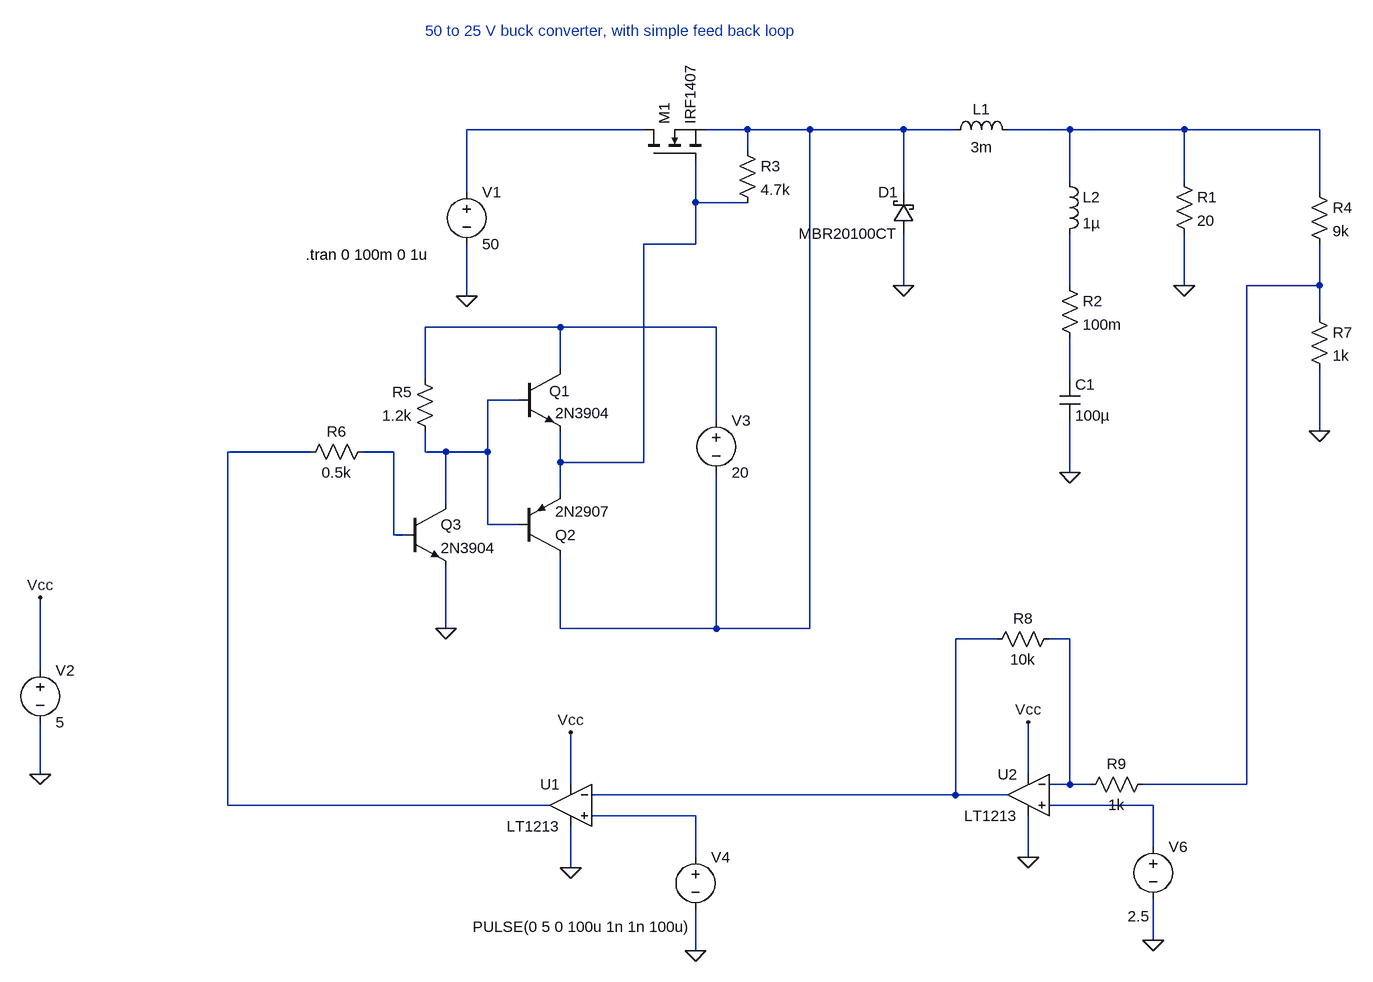
[diagram p0: schematic buck_converter.asc]
buck_converter.asc, the LTspice schematic file:
Version 4
SHEET 1 1340 1476
WIRE -208 32 -480 32
WIRE -48 32 -112 32
WIRE 48 32 -48 32
WIRE 192 32 48 32
WIRE 272 32 192 32
WIRE 448 32 352 32
WIRE 624 32 448 32
WIRE 832 32 624 32
WIRE -48 64 -48 32
WIRE 448 112 448 32
WIRE 624 112 624 32
WIRE -480 128 -480 32
WIRE 192 128 192 32
WIRE 832 128 832 32
WIRE -128 144 -128 80
WIRE -48 144 -128 144
WIRE -128 208 -128 144
WIRE -128 208 -208 208
WIRE 192 272 192 192
WIRE 448 272 448 192
WIRE 624 272 624 192
WIRE 832 272 832 208
WIRE 832 272 720 272
WIRE -480 288 -480 208
WIRE 832 320 832 272
WIRE -336 336 -544 336
WIRE -96 336 -336 336
WIRE -336 400 -336 336
WIRE -544 416 -544 336
WIRE 448 416 448 352
WIRE -400 448 -448 448
WIRE -96 480 -96 336
WIRE 832 496 832 400
WIRE -720 528 -848 528
WIRE -592 528 -640 528
WIRE -544 528 -544 496
WIRE -512 528 -544 528
WIRE -448 528 -448 448
WIRE -448 528 -512 528
WIRE -336 544 -336 496
WIRE -208 544 -208 208
WIRE -208 544 -336 544
WIRE 448 560 448 480
WIRE -336 592 -336 544
WIRE -512 608 -512 528
WIRE -448 640 -448 528
WIRE -400 640 -448 640
WIRE -592 656 -592 528
WIRE -576 656 -592 656
WIRE -512 800 -512 704
WIRE -336 800 -336 688
WIRE -96 800 -96 560
WIRE -96 800 -336 800
WIRE 48 800 48 32
WIRE 48 800 -96 800
WIRE 336 816 272 816
WIRE 448 816 416 816
WIRE -1136 864 -1136 752
WIRE -1136 1024 -1136 944
WIRE 384 1024 384 944
WIRE -320 1040 -320 960
WIRE 448 1040 448 816
WIRE 448 1040 416 1040
WIRE 480 1040 448 1040
WIRE 720 1040 720 272
WIRE 720 1040 560 1040
WIRE 272 1056 272 816
WIRE 272 1056 -288 1056
WIRE 352 1056 272 1056
WIRE -848 1072 -848 528
WIRE -352 1072 -848 1072
WIRE 576 1072 416 1072
WIRE -128 1088 -288 1088
WIRE 576 1136 576 1072
WIRE -128 1152 -128 1088
WIRE 384 1152 384 1088
WIRE -320 1168 -320 1104
WIRE 576 1280 576 1216
WIRE -128 1296 -128 1232
FLAG 192 272 0
FLAG -480 288 0
FLAG 448 560 0
FLAG 624 272 0
FLAG -512 800 0
FLAG -1136 1024 0
FLAG -1136 752 Vcc
FLAG -320 960 Vcc
FLAG -320 1168 0
FLAG -128 1296 0
FLAG 384 944 Vcc
FLAG 384 1152 0
FLAG 576 1280 0
FLAG 832 496 0
SYMBOL voltage -480 112 R0
WINDOW 123 0 0 Left 0
WINDOW 39 0 0 Left 0
SYMATTR InstName V1
SYMATTR Value 50
SYMBOL nmos -208 80 R270
SYMATTR InstName M1
SYMATTR Value IRF1407
SYMBOL ind 256 48 R270
WINDOW 0 32 56 VTop 2
WINDOW 3 5 56 VBottom 2
SYMATTR InstName L1
SYMATTR Value 3m
SYMBOL schottky 208 192 R180
WINDOW 0 24 64 Left 2
WINDOW 3 24 0 Left 2
SYMATTR InstName D1
SYMATTR Value MBR20100CT
SYMATTR Description Diode
SYMATTR Type diode
SYMBOL cap 432 416 R0
SYMATTR InstName C1
SYMATTR Value 100µ
SYMBOL res 608 96 R0
SYMATTR InstName R1
SYMATTR Value 20
SYMBOL res 432 256 R0
SYMATTR InstName R2
SYMATTR Value 100m
SYMBOL ind 432 96 R0
SYMATTR InstName L2
SYMATTR Value 1µ
SYMBOL res -64 48 R0
SYMATTR InstName R3
SYMATTR Value 4.7k
SYMBOL npn -400 400 R0
WINDOW 0 47 34 Left 2
SYMATTR InstName Q1
SYMATTR Value 2N3904
SYMBOL res -528 512 R180
WINDOW 0 36 76 Left 2
WINDOW 3 36 40 Left 2
SYMATTR InstName R5
SYMATTR Value 1.2k
SYMBOL pnp -400 688 M180
SYMATTR InstName Q2
SYMATTR Value 2N2907
SYMBOL res -624 512 R90
WINDOW 0 0 56 VBottom 2
WINDOW 3 32 56 VTop 2
SYMATTR InstName R6
SYMATTR Value 0.5k
SYMBOL npn -576 608 R0
SYMATTR InstName Q3
SYMATTR Value 2N3904
SYMBOL voltage -96 464 R0
WINDOW 123 0 0 Left 0
WINDOW 39 0 0 Left 0
SYMATTR InstName V3
SYMATTR Value 20
SYMBOL OpAmps\\LT1213 -320 1008 M0
SYMATTR InstName U1
SYMBOL voltage -1136 848 R0
WINDOW 123 0 0 Left 0
WINDOW 39 0 0 Left 0
SYMATTR InstName V2
SYMATTR Value 5
SYMBOL voltage -128 1136 R0
WINDOW 123 0 0 Left 0
WINDOW 39 0 0 Left 0
WINDOW 3 -5 123 Right 2
SYMATTR InstName V4
SYMATTR Value PULSE(0 5 0 100u 1n 1n 100u)
SYMBOL OpAmps\\LT1213 384 992 M0
SYMATTR InstName U2
SYMBOL voltage 576 1120 R0
WINDOW 123 0 0 Left 0
WINDOW 39 0 0 Left 0
WINDOW 3 -5 123 Right 2
SYMATTR InstName V6
SYMATTR Value 2.5
SYMBOL res 816 112 R0
SYMATTR InstName R4
SYMATTR Value 9k
SYMBOL res 816 304 R0
SYMATTR InstName R7
SYMATTR Value 1k
SYMBOL res 432 800 R90
WINDOW 0 0 56 VBottom 2
WINDOW 3 32 56 VTop 2
SYMATTR InstName R8
SYMATTR Value 10k
SYMBOL res 576 1024 R90
WINDOW 0 0 56 VBottom 2
WINDOW 3 32 56 VTop 2
SYMATTR InstName R9
SYMATTR Value 1k
TEXT -728 224 Left 2 !.tran 0 100m 0 1u
TEXT -544 -120 Left 2 ;50 to 25 V buck converter, with simple feed back loop

The netlist it stands for:
* buck_converter.asc
V1 N001 0 50
M1 N001 N004 N002 N002 IRF1407
L1 N002 N003 3m
D1 0 N002 MBR20100CT
C1 N008 0 100µ
R1 N003 0 20
R2 N005 N008 100m
L2 N003 N005 1µ
R3 N002 N004 4.7k
Q1 N007 N009 N004 0 2N3904
R5 N009 N007 1.2k
Q2 N002 N009 N004 0 2N2907
R6 N011 N010 0.5k
Q3 N009 N011 0 0 2N3904
V3 N007 N002 20
XU1 N015 N012 Vcc 0 N010 LT1213  ; pins In+ In- V+ V- OUT
V2 Vcc 0 5
V4 N015 0 PULSE(0 5 0 100u 1n 1n 100u)
XU2 N014 N013 Vcc 0 N012 LT1213  ; pins In+ In- V+ V- OUT
V6 N014 0 2.5
R4 N003 N006 9k
R7 N006 0 1k
R8 N013 N012 10k
R9 N006 N013 1k
.model D D
.lib standard.dio
.model NPN NPN
.model PNP PNP
.lib standard.bjt
.model NMOS NMOS
.model PMOS PMOS
.lib standard.mos
.tran 0 100m 0 1u
* 50 to 25 V buck converter, with simple feed back loop
.lib LTC.lib
.backanno
.end